# EAGLE schematic bms_v01 (EAGLE 6.5.0)
AUTHOR: John English; VERSION: 2015-02-16

## Sheet 1 of 3
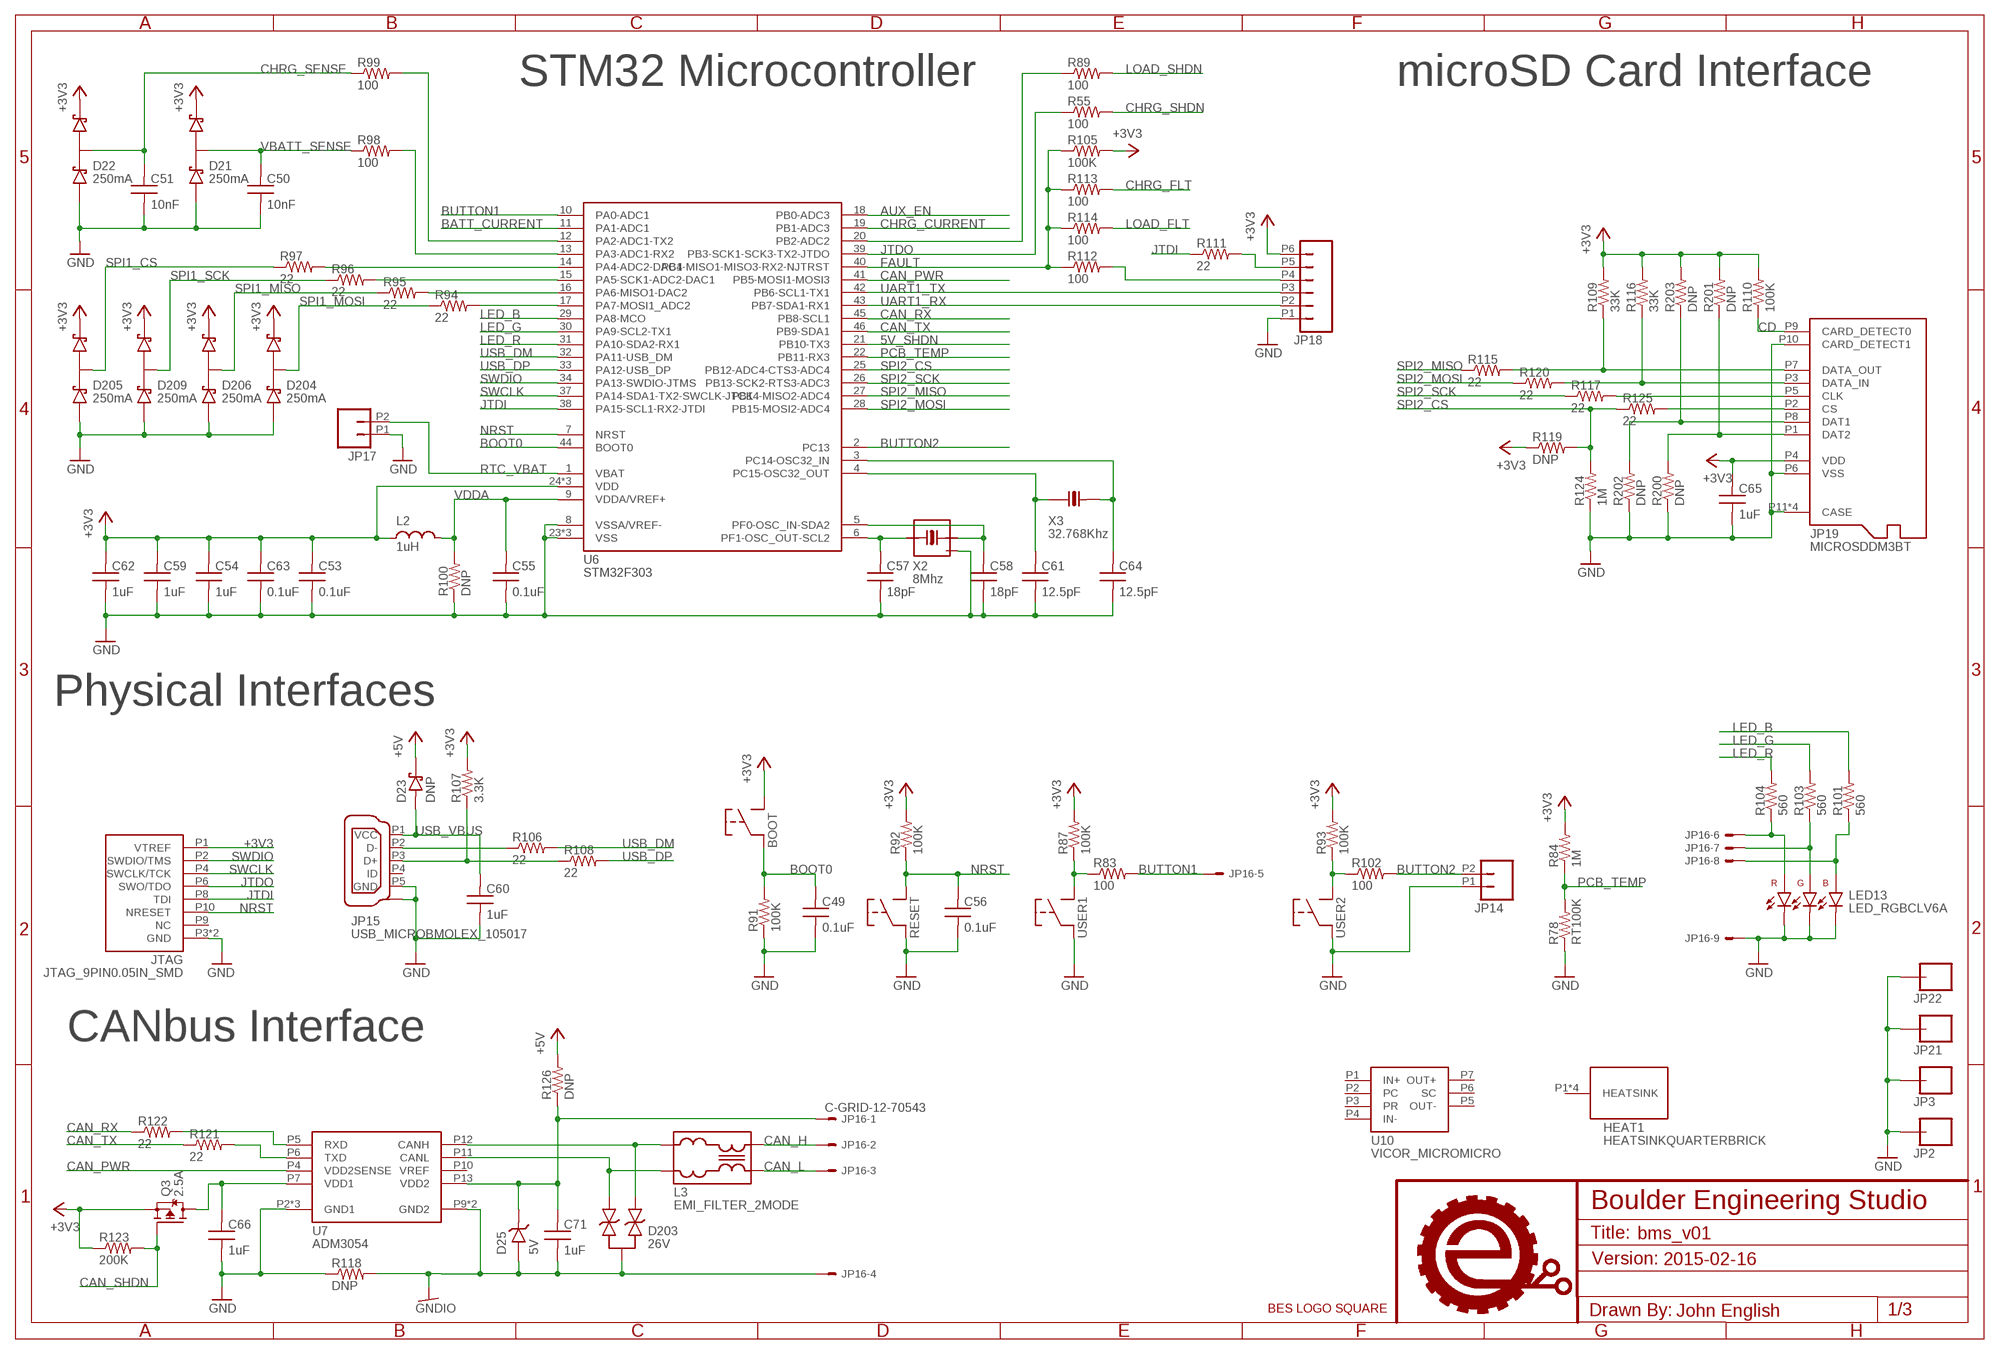
[diagram p0: schematic, sheet 1]

### Parts
BOOT  SWITCH_MOMENTEVQP2  [MOMENTARY_SW_EVQP2]
C49  0.1uF  CAPACITORC_0603_SILK  [0603_SILK]
C50  10nF  CAPACITORC_0603_SILK  [0603_SILK]
C51  10nF  CAPACITORC_0603_SILK  [0603_SILK]
C53  0.1uF  CAPACITORC_0603_SILK  [0603_SILK]
C54  1uF  CAPACITORC_0603_SILK  [0603_SILK]
C55  0.1uF  CAPACITORC_0603_SILK  [0603_SILK]
C56  0.1uF  CAPACITORC_0603_SILK  [0603_SILK]
C57  18pF  CAPACITORC_0603_SILK  [0603_SILK]
C58  18pF  CAPACITORC_0603_SILK  [0603_SILK]
C59  1uF  CAPACITORC_0603_SILK  [0603_SILK]
C60  1uF  CAPACITORC_0603_SILK  [0603_SILK]
C61  12.5pF  CAPACITORC_0603_SILK  [0603_SILK]
C62  1uF  CAPACITORC_0603_SILK  [0603_SILK]
C63  0.1uF  CAPACITORC_0603_SILK  [0603_SILK]
C64  12.5pF  CAPACITORC_0603_SILK  [0603_SILK]
C65  1uF  CAPACITORC_0603_SILK  [0603_SILK]
C66  1uF  CAPACITORC_0603_SILK  [0603_SILK]
C71  1uF  CAPACITORC_0603_SILK  [0603_SILK]
D21  250mA  DIODE_SCHOTTKY_SERIESSOT23  [SOT23]
D22  250mA  DIODE_SCHOTTKY_SERIESSOT23  [SOT23]
D23  DNP  DIODE_SCHOTTKYSOT23  [SOT23]
D25  5V  ZENERSOT23  [SOT23]
D203  26V  SUPPRESSOR_DUALSOT23  [SOT23]
D204  250mA  DIODE_SCHOTTKY_SERIESSOT23  [SOT23]
D205  250mA  DIODE_SCHOTTKY_SERIESSOT23  [SOT23]
D206  250mA  DIODE_SCHOTTKY_SERIESSOT23  [SOT23]
D209  250mA  DIODE_SCHOTTKY_SERIESSOT23  [SOT23]
HEAT1  HEATSINKQUARTERBRICK  [HEATSINK_BRICK_QUARTER]
JP2  CONNECTOR-1PIN3.5MM  [HOLE_3.5MM]
JP3  CONNECTOR-1PIN3.5MM  [HOLE_3.5MM]
JP14  HEADER-2PIN2MM  [HEADER_2MM_2PIN]
JP15  USB_MICROBMOLEX_105017  [USB-MICRO-B-MOLEX_105017]
JP16  C-GRID-12-70543  [70543-12]
JP17  HEADER-2PIN0.05IN  [HEADER-SMALL-2PIN00.05IN]
JP18  HEADER-6PIN2MM  [HEADER_2MM_6PIN]
JP19  MICROSDDM3BT  [MICROSD_DM3BT]
JP21  CONNECTOR-1PIN3.5MM  [HOLE_3.5MM]
JP22  CONNECTOR-1PIN3.5MM  [HOLE_3.5MM]
JTAG  JTAG_9PIN0.05IN_SMD  [JTAG_9PIN_0.05IN_SMD]
L2  1uH  INDUCTOR0603_SILK  [0603_SILK]
L3  EMI_FILTER_2MODE  [FILTER_EXC24CX]
LED13  LED_RGBCLV6A  [RGB_LED_CLV6A]
LOGO1  LOGOSILK_0.325IN  [LOGO_SILK_0.325IN]
Q3  2.5A  MOSFET_PSOT23  [SOT23]
R55  100  RESISTORR_0603_SILK  [0603_SILK]
R78  RT100K  RESISTORR_0603_SILK  [0603_SILK]
R83  100  RESISTORR_0603_SILK  [0603_SILK]
R84  1M  RESISTORR_0603_SILK  [0603_SILK]
R87  100K  RESISTORR_0603_SILK  [0603_SILK]
R89  100  RESISTORR_0603_SILK  [0603_SILK]
R91  100K  RESISTORR_0603_SILK  [0603_SILK]
R92  100K  RESISTORR_0603_SILK  [0603_SILK]
R93  100K  RESISTORR_0603_SILK  [0603_SILK]
R94  22  RESISTORR_0603_SILK  [0603_SILK]
R95  22  RESISTORR_0603_SILK  [0603_SILK]
R96  22  RESISTORR_0603_SILK  [0603_SILK]
R97  22  RESISTORR_0603_SILK  [0603_SILK]
R98  100  RESISTORR_0603_SILK  [0603_SILK]
R99  100  RESISTORR_0603_SILK  [0603_SILK]
R100  DNP  RESISTORR_0603_SILK  [0603_SILK]
R101  560  RESISTORR_0603_SILK  [0603_SILK]
R102  100  RESISTORR_0603_SILK  [0603_SILK]
R103  560  RESISTORR_0603_SILK  [0603_SILK]
R104  560  RESISTORR_0603_SILK  [0603_SILK]
R105  100K  RESISTORR_0603_SILK  [0603_SILK]
R106  22  RESISTORR_0603_SILK  [0603_SILK]
R107  3.3K  RESISTORR_0603_SILK  [0603_SILK]
R108  22  RESISTORR_0603_SILK  [0603_SILK]
R109  33K  RESISTORR_0603_SILK  [0603_SILK]
R110  100K  RESISTORR_0603_SILK  [0603_SILK]
R111  22  RESISTORR_0603_SILK  [0603_SILK]
R112  100  RESISTORR_0603_SILK  [0603_SILK]
R113  100  RESISTORR_0603_SILK  [0603_SILK]
R114  100  RESISTORR_0603_SILK  [0603_SILK]
R115  22  RESISTORR_0603_SILK  [0603_SILK]
R116  33K  RESISTORR_0603_SILK  [0603_SILK]
R117  22  RESISTORR_0603_SILK  [0603_SILK]
R118  DNP  RESISTORR_0603_SILK  [0603_SILK]
R119  DNP  RESISTORR_0603_SILK  [0603_SILK]
R120  22  RESISTORR_0603_SILK  [0603_SILK]
R121  22  RESISTORR_0603_SILK  [0603_SILK]
R122  22  RESISTORR_0603_SILK  [0603_SILK]
R123  200K  RESISTORR_0603_SILK  [0603_SILK]
R124  1M  RESISTORR_0603_SILK  [0603_SILK]
R125  22  RESISTORR_0603_SILK  [0603_SILK]
R126  DNP  RESISTORR_0603_SILK  [0603_SILK]
R200  DNP  RESISTORR_0603_SILK  [0603_SILK]
R201  DNP  RESISTORR_0603_SILK  [0603_SILK]
R202  DNP  RESISTORR_0603_SILK  [0603_SILK]
R203  DNP  RESISTORR_0603_SILK  [0603_SILK]
RESET  SWITCH_MOMENTEVQP2  [MOMENTARY_SW_EVQP2]
U6  STM32F303  [TQFP48]
U7  ADM3054  [SOIC-16_W_ANALOG]
U10  VICOR_MICROMICRO  [VICOR_QUARTER]
USER1  SWITCH_MOMENTEVQP2  [MOMENTARY_SW_EVQP2]
USER2  SWITCH_MOMENTEVQP2  [MOMENTARY_SW_EVQP2]
X2  8Mhz  CRYSTAL_ABRACOM_ABABM10  [ABRACOM_CLOCK]
X3  32.768Khz  CRYSTALABS07  [ABS07]

### Nets
5V_SHDN: U6.21(PB10-TX3) ; also sheet 2,3
+3V3: BOOT.P2 BOOT.P4(P2) C53.P1 C54.P1 C59.P1 C62.P1 C63.P1 C65.P1 D21.2(C) D22.2(C) D204.2(C) D205.2(C) D206.2(C) D209.2(C) JP18.P6 JP19.P4(VDD) JTAG.P1(VTREF) L2.P1 Q3.2(S) R84.P2 R87.P2 R92.P2 R93.P2 R105.P2 R107.P2 R109.P2 R110.P2 R116.P2 R119.P1 R123.P1 R201.P2 R203.P2 U6.24(VDD) U6.36(VDD) U6.48(VDD) ; also sheet 2
+5V: D23.3(C) R126.P2 ; also sheet 2
AUX_EN: U6.18(PB0-ADC3) ; also sheet 2
BATT_CURRENT: U6.11(PA1-ADC1) ; also sheet 2
BOOT0: BOOT.P1 BOOT.P3(P1) C49.P1 R91.P2 U6.44(BOOT0)
BUTTON1: JP16.5 R83.P2 U6.10(PA0-ADC1)
BUTTON2: JP14.P2 R102.P2 U6.2(PC13)
CAN_H: JP16.2 L3.P4
CAN_L: JP16.3 L3.P3
CAN_PWR: U6.41(PB5-MOSI1-MOSI3) U7.P4(VDD2SENSE)
CAN_RX: R122.P1 U6.45(PB8-SCL1)
CAN_SHDN: Q3.1(G) R123.P2 ; also sheet 3
CAN_TX: R121.P1 U6.46(PB9-SDA1)
CAN_VDD: C71.P1 D25.3(C) JP16.1 R126.P1 U7.P13(VDD2)
CD: JP19.P9(CARD_DETECT0) R110.P1
CHRG_CURRENT: U6.19(PB1-ADC3) ; also sheet 2
CHRG_FLT: R113.P2 ; also sheet 2
CHRG_SENSE: C51.P1 D22.3(MID) R99.P1 ; also sheet 2
CHRG_SHDN: R55.P2 ; also sheet 2,3
FAULT: R105.P1 R112.P1 R113.P1 R114.P1 U6.40(PB4-MISO1-MISO3-RX2-NJTRST)
GND: C49.P2 C50.P2 C51.P2 C53.P2 C54.P2 C55.P2 C56.P2 C57.P2 C58.P2 C59.P2 C60.P2 C61.P2 C62.P2 C63.P2 C64.P2 C65.P2 C66.P2 D21.1(A) D22.1(A) D204.1(A) D205.1(A) D206.1(A) D209.1(A) JP2.P$1 JP3.P$1 JP14.P1 JP15.P5(GND) JP15.PAD1(CASE) JP15.PAD2(CASE) JP15.PAD3(CASE) JP15.PAD3-HOLE(CASE) JP15.PAD4(CASE) JP15.PAD4-HOLE(CASE) JP15.THRUPAD1(CASE) JP15.THRUPAD2(CASE) JP16.9 JP17.P1 JP18.P1 JP19.P6(VSS) JP19.P10(CARD_DETECT1) JP19.P11(CASE) JP19.P12(CASE) JP19.P13(CASE) JP19.P14(CASE) JP21.P$1 JP22.P$1 JTAG.P3(GND) JTAG.P5(GND) LED13.1(BC) LED13.2(GC) LED13.3(RC) R78.P1 R91.P1 R100.P1 R118.P1 R124.P1 R200.P1 R202.P1 RESET.P1 RESET.P3(P1) U6.8(VSSA/VREF-) U6.23(VSS) U6.35(VSS) U6.47(VSS) U7.P2(GND1) U7.P3(GND1) U7.P8(GND1) USER1.P1 USER1.P3(P1) USER2.P1 USER2.P3(P1) X2.2(CASE) X2.4(CASE) ; also sheet 2,3
GNDIO: C71.P2 D25.1(A) D203.3(C1) JP16.4 R118.P2 U7.P9(GND2) U7.P16(GND2)
JTDI: JTAG.P8(TDI) R111.P1 U6.38(PA15-SCL1-RX2-JTDI)
JTDO: JTAG.P6(SWO/TDO) R55.P1 U6.39(PB3-SCK1-SCK3-TX2-JTDO)
LED_B: R101.P2 U6.29(PA8-MCO)
LED_G: R103.P2 U6.30(PA9-SCL2-TX1)
LED_R: R104.P2 U6.31(PA10-SDA2-RX1)
LOAD_FLT: R114.P2 ; also sheet 2
LOAD_SHDN: R89.P2 ; also sheet 2,3
N$2: C66.P1 Q3.3(D) U7.P7(VDD1)
N$6: D203.1(A) L3.P2 U7.P11(CANL)
N$25: R99.P2 U6.12(PA2-ADC1-TX2)
N$28: R83.P1 R87.P1 USER1.P2 USER1.P4(P2)
N$31: JP15.P2(D-) R106.P1
N$34: R93.P1 R102.P1 USER2.P2 USER2.P4(P2)
N$37: R89.P1 U6.20(PB2-ADC2)
N$39: R98.P2 U6.13(PA3-ADC1-RX2)
N$46: C58.P1 U6.5(PF0-OSC_IN-SDA2) X2.3(3A)
N$58: JP15.P3(D+) R107.P1 R108.P1
N$62: R94.P2 U6.17(PA7-MOSI1_ADC2)
N$66: R95.P2 U6.16(PA6-MISO1-DAC2)
N$71: C57.P1 U6.6(PF1-OSC_OUT-SCL2) X2.1(1A)
N$72: R96.P2 U6.15(PA5-SCK1-ADC2-DAC1)
N$73: JP19.P1(DAT2) R200.P2 R201.P1
N$74: JP19.P8(DAT1) R202.P2 R203.P1
N$75: JP19.P3(DATA_IN) R116.P1 R120.P2
N$76: JP19.P7(DATA_OUT) R109.P1 R115.P2
N$80: D203.2(A1) L3.P1 U7.P12(CANH)
N$81: R121.P2 U7.P6(TXD)
N$82: R122.P2 U7.P5(RXD)
N$85: R97.P2 U6.14(PA4-ADC2-DAC1)
N$95: C61.P1 U6.4(PC15-OSC32_OUT) X3.P1(1A)
N$96: C64.P1 U6.3(PC14-OSC32_IN) X3.P2(3A)
N$98: JP18.P4 R112.P2
N$100: JP18.P5 R111.P2
N$107: JP19.P5(CLK) R117.P2
N$142: JP19.P2(CS) R125.P2
N$143: JP16.6 LED13.4(RA) R104.P1
N$144: JP16.7 LED13.5(GA) R103.P1
N$294: JP16.8 LED13.6(BA) R101.P1
NRST: C56.P1 JTAG.P10(NRESET) R92.P1 RESET.P2 RESET.P4(P2) U6.7(NRST)
PCB_TEMP: R78.P2 R84.P1 U6.22(PB11-RX3)
RTC_VBAT: JP17.P2 U6.1(VBAT)
SPI1_CS: D205.3(MID) R97.P1 ; also sheet 3
SPI1_MISO: D206.3(MID) R95.P1 ; also sheet 3
SPI1_MOSI: D204.3(MID) R94.P1 ; also sheet 3
SPI1_SCK: D209.3(MID) R96.P1 ; also sheet 3
SPI2_CS: R119.P2 R124.P2 R125.P1 U6.25(PB12-ADC4-CTS3-ADC4)
SPI2_MISO: R115.P1 U6.27(PB14-MISO2-ADC4)
SPI2_MOSI: R120.P1 U6.28(PB15-MOSI2-ADC4)
SPI2_SCK: R117.P1 U6.26(PB13-SCK2-RTS3-ADC3)
SWCLK: JTAG.P4(SWCLK/TCK) U6.37(PA14-SDA1-TX2-SWCLK-JTCK)
SWDIO: JTAG.P2(SWDIO/TMS) U6.34(PA13-SWDIO-JTMS)
UART1_RX: JP18.P2 U6.43(PB7-SDA1-RX1)
UART1_TX: JP18.P3 U6.42(PB6-SCL1-TX1)
USB_DM: R106.P2 U6.32(PA11-USB_DM)
USB_DP: R108.P2 U6.33(PA12-USB_DP)
USB_VBUS: C60.P1 D23.1(A) JP15.P1(VCC)
VBATT_SENSE: C50.P1 D21.3(MID) R98.P1 ; also sheet 2
VDDA: C55.P1 L2.P2 R100.P2 U6.9(VDDA/VREF+)
Unconnected: HEAT1.P1(HEATSINK) HEAT1.P2(HEATSINK) HEAT1.P3(HEATSINK) HEAT1.P4(HEATSINK) JP15.P4(ID) JTAG.P9(NC) U7.P10(VREF) U10.P1(IN+) U10.P2(PC) U10.P3(PR) U10.P4(IN-) U10.P5(OUT-) U10.P6(SC) U10.P7(OUT+)

### Notes on the sheet
- STM32 Microcontroller | microSD Card Interface
- Physical Interfaces
- CANbus Interface

## Sheet 2 of 3
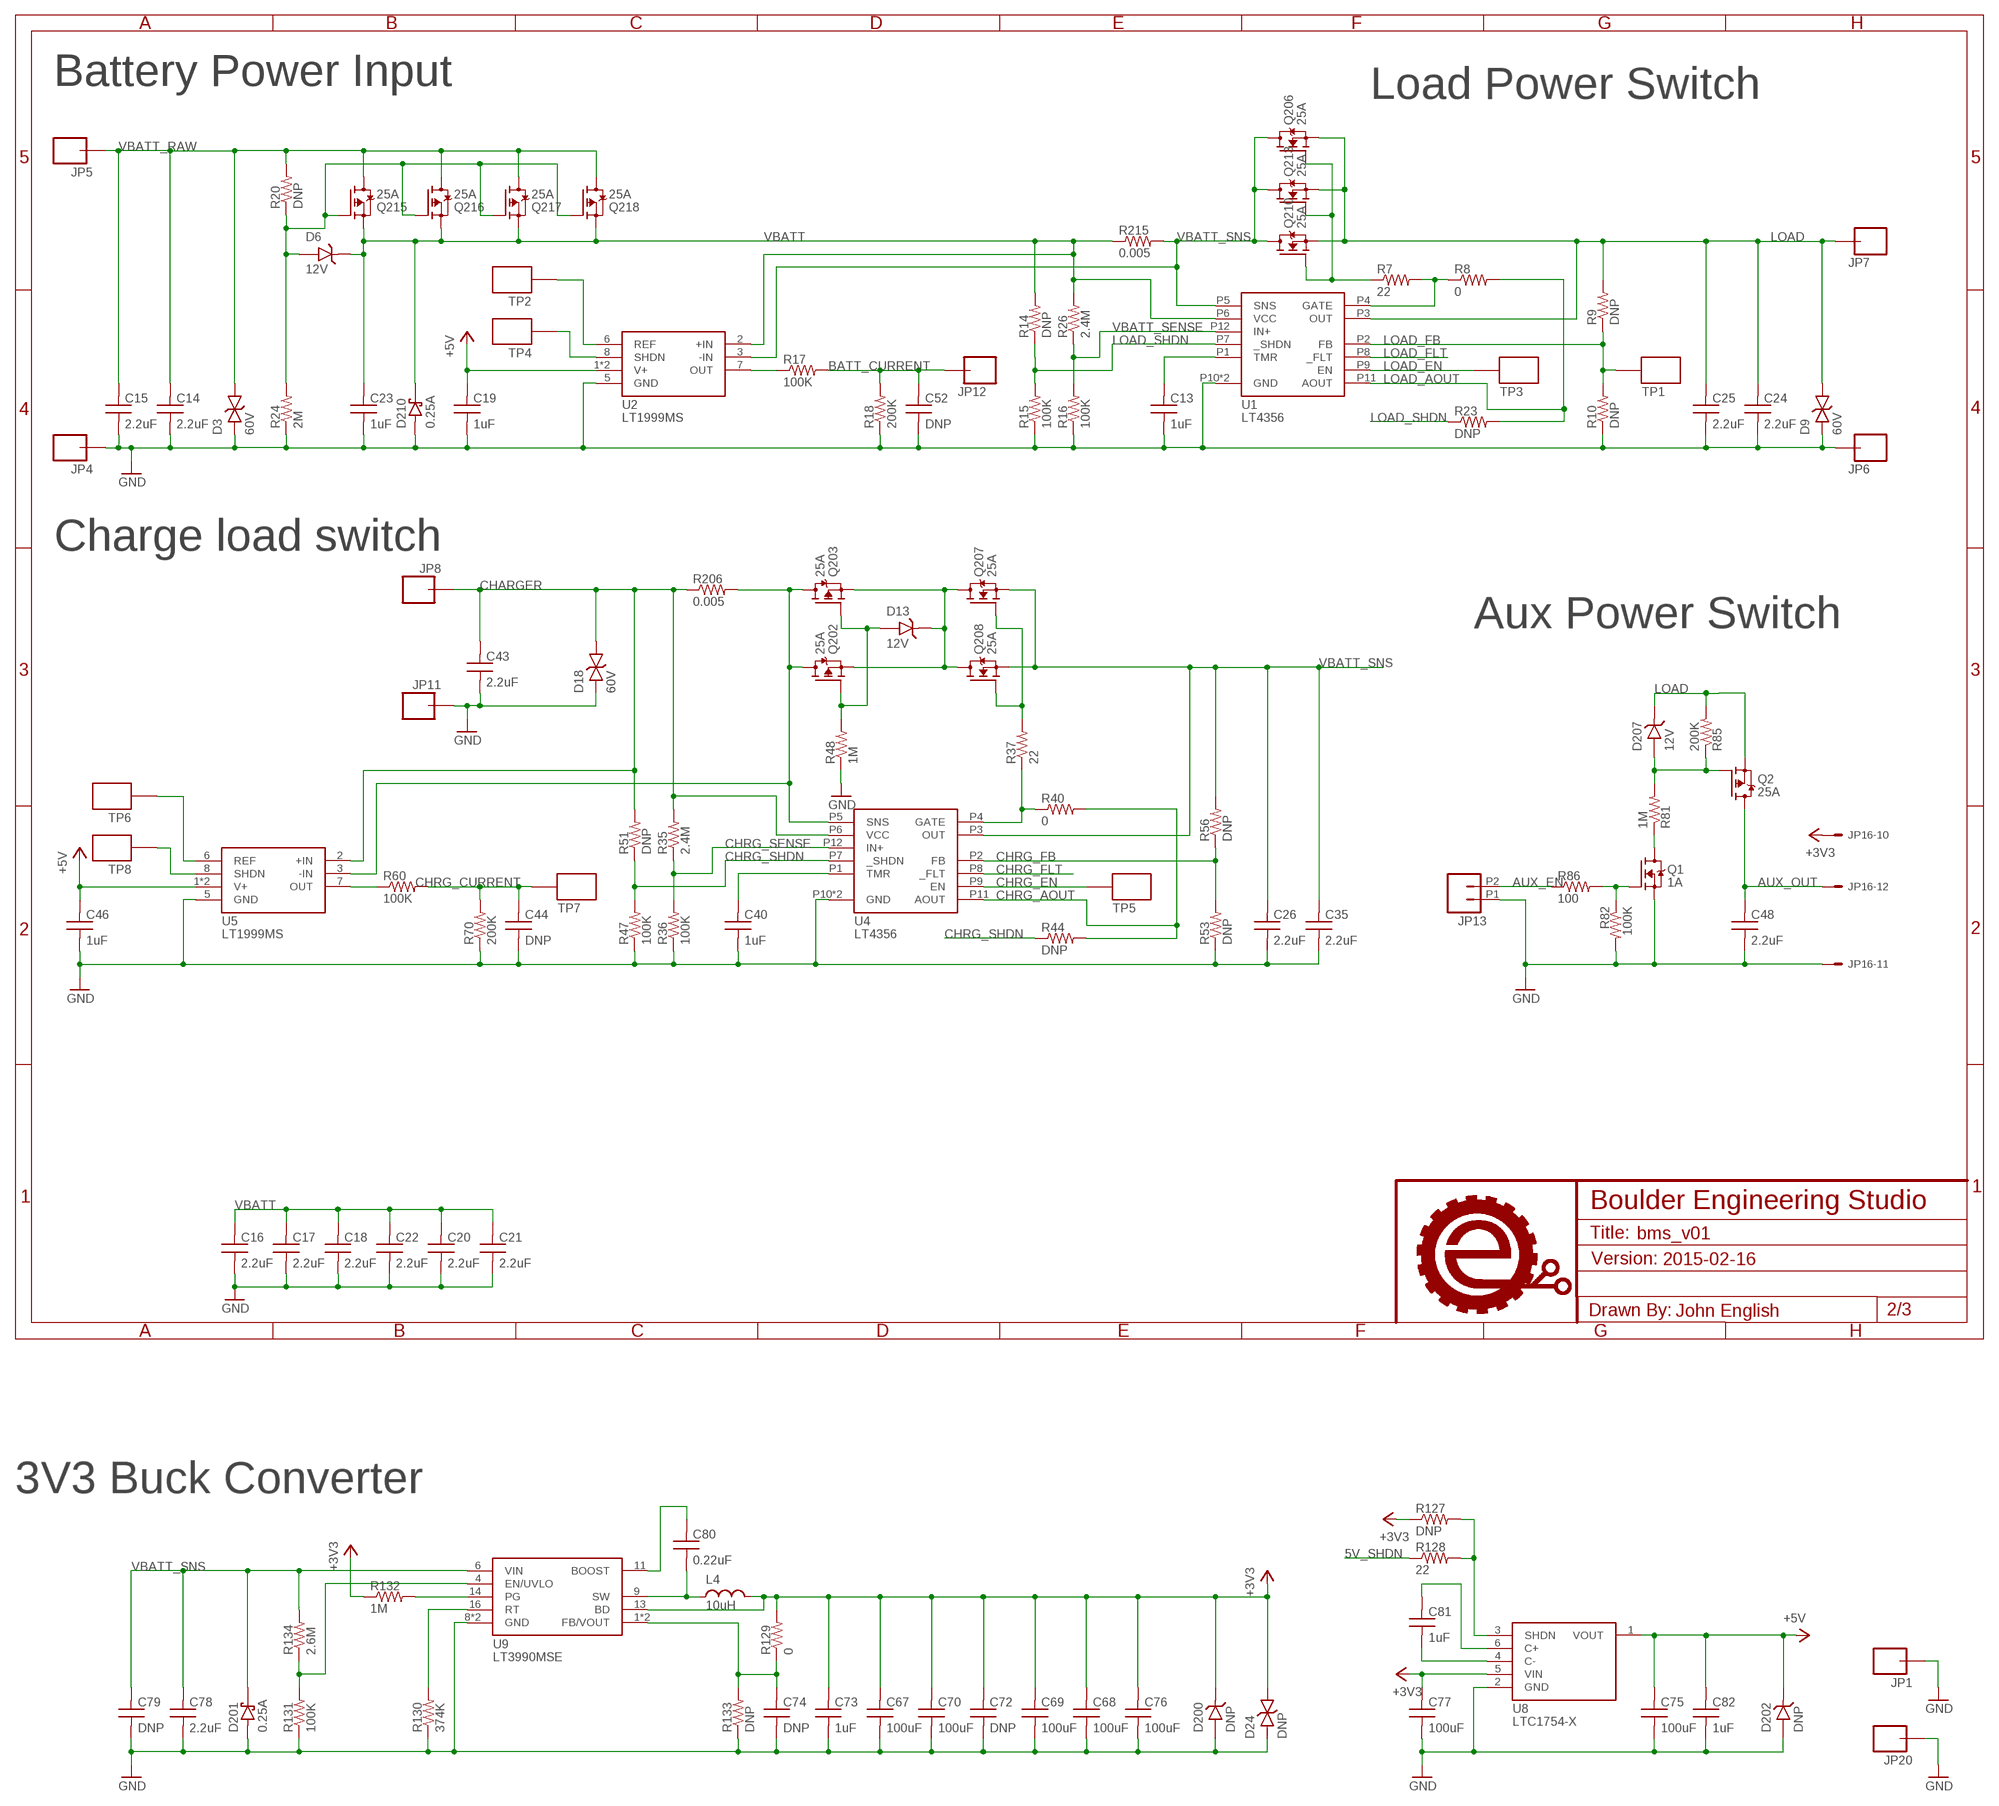
[diagram p1: schematic, sheet 2]

### Parts
C13  1uF  CAPACITORC_0603_SILK  [0603_SILK]
C14  2.2uF  CAPACITOR1210_SILK  [1210_SILK]
C15  2.2uF  CAPACITOR1210_SILK  [1210_SILK]
C16  2.2uF  CAPACITOR1210_SILK  [1210_SILK]
C17  2.2uF  CAPACITOR1210_SILK  [1210_SILK]
C18  2.2uF  CAPACITOR1210_SILK  [1210_SILK]
C19  1uF  CAPACITORC_0603_SILK  [0603_SILK]
C20  2.2uF  CAPACITOR1210_SILK  [1210_SILK]
C21  2.2uF  CAPACITOR1210_SILK  [1210_SILK]
C22  2.2uF  CAPACITOR1210_SILK  [1210_SILK]
C23  1uF  CAPACITORC_0603_SILK  [0603_SILK]
C24  2.2uF  CAPACITOR1210_SILK  [1210_SILK]
C25  2.2uF  CAPACITOR1210_SILK  [1210_SILK]
C26  2.2uF  CAPACITOR1210_SILK  [1210_SILK]
C35  2.2uF  CAPACITOR1210_SILK  [1210_SILK]
C40  1uF  CAPACITORC_0603_SILK  [0603_SILK]
C43  2.2uF  CAPACITOR1210_SILK  [1210_SILK]
C44  DNP  CAPACITORC_0603_SILK  [0603_SILK]
C46  1uF  CAPACITORC_0603_SILK  [0603_SILK]
C48  2.2uF  CAPACITOR1210_SILK  [1210_SILK]
C52  DNP  CAPACITORC_0603_SILK  [0603_SILK]
C67  100uF  CAPACITORC_1206_SILK  [1206_SILK]
C68  100uF  CAPACITORC_1206_SILK  [1206_SILK]
C69  100uF  CAPACITORC_1206_SILK  [1206_SILK]
C70  100uF  CAPACITORC_1206_SILK  [1206_SILK]
C72  DNP  CAPACITORC_0603_SILK  [0603_SILK]
C73  1uF  CAPACITORC_0603_SILK  [0603_SILK]
C74  DNP  CAPACITORC_0603_SILK  [0603_SILK]
C75  100uF  CAPACITORC_1206_SILK  [1206_SILK]
C76  100uF  CAPACITORC_1206_SILK  [1206_SILK]
C77  100uF  CAPACITORC_1206_SILK  [1206_SILK]
C78  2.2uF  CAPACITOR1210_SILK  [1210_SILK]
C79  DNP  CAPACITORC_0603_SILK  [0603_SILK]
C80  0.22uF  CAPACITORC_0603_SILK  [0603_SILK]
C81  1uF  CAPACITORC_0603_SILK  [0603_SILK]
C82  1uF  CAPACITORC_0603_SILK  [0603_SILK]
D3  60V  SURGESUPPRESSORSMC  [SMC]
D6  12V  ZENERSOT23  [SOT23]
D9  60V  SURGESUPPRESSORSMC  [SMC]
D13  12V  ZENERSOT23  [SOT23]
D18  60V  SURGESUPPRESSORSMC  [SMC]
D24  DNP  SURGESUPPRESSORSMA  [SMA]
D200  DNP  ZENERSOT23  [SOT23]
D201  0.25A  DIODE_SCHOTTKYSOT23  [SOT23]
D202  DNP  ZENERSOT23  [SOT23]
D207  12V  ZENERSOT23  [SOT23]
D210  0.25A  DIODE_SCHOTTKYSOT23  [SOT23]
JP1  HEADER-1PIN0.036IN  [HEADER-SMALL-1PIN-0.036IN]
JP4  CONNECTOR-1PIN3MM  [HOLE_3MM]
JP5  CONNECTOR-1PIN3MM  [HOLE_3MM]
JP6  CONNECTOR-1PIN3MM  [HOLE_3MM]
JP7  CONNECTOR-1PIN3MM  [HOLE_3MM]
JP8  CONNECTOR-1PIN3MM  [HOLE_3MM]
JP11  CONNECTOR-1PIN3MM  [HOLE_3MM]
JP12  HEADER-1PIN0.02IN  [HEADER-SMALL-1PIN-0.02IN]
JP13  HEADER-2PIN2MM  [HEADER_2MM_2PIN]
JP20  HEADER-1PIN0.036IN  [HEADER-SMALL-1PIN-0.036IN]
L4  10uH  INDUCTORRL895  [INDUCTOR_RL895]
Q1  1A  MOSFET_NSOT23  [SOT23]
Q2  25A  MOSFET_PPOWERPAK_SO8  [POWERPAK_SO-8_SINGLE]
Q202  25A  MOSFET_PPOWERPAK_SO8  [POWERPAK_SO-8_SINGLE]
Q203  25A  MOSFET_PPOWERPAK_SO8  [POWERPAK_SO-8_SINGLE]
Q206  25A  MOSFET_NPOWERPAK_SO8  [POWERPAK_SO-8_SINGLE]
Q207  25A  MOSFET_NPOWERPAK_SO8  [POWERPAK_SO-8_SINGLE]
Q208  25A  MOSFET_NPOWERPAK_SO8  [POWERPAK_SO-8_SINGLE]
Q210  25A  MOSFET_NPOWERPAK_SO8  [POWERPAK_SO-8_SINGLE]
Q213  25A  MOSFET_NPOWERPAK_SO8  [POWERPAK_SO-8_SINGLE]
Q215  25A  MOSFET_PPOWERPAK_SO8  [POWERPAK_SO-8_SINGLE]
Q216  25A  MOSFET_PPOWERPAK_SO8  [POWERPAK_SO-8_SINGLE]
Q217  25A  MOSFET_PPOWERPAK_SO8  [POWERPAK_SO-8_SINGLE]
Q218  25A  MOSFET_PPOWERPAK_SO8  [POWERPAK_SO-8_SINGLE]
R7  22  RESISTORR_0805_SILK  [0805_SILK]
R8  0  RESISTORR_0805_SILK  [0805_SILK]
R9  DNP  RESISTORR_0603_SILK  [0603_SILK]
R10  DNP  RESISTORR_0603_SILK  [0603_SILK]
R14  DNP  RESISTORR_0603_SILK  [0603_SILK]
R15  100K  RESISTORR_0603_SILK  [0603_SILK]
R16  100K  RESISTORR_0603_SILK  [0603_SILK]
R17  100K  RESISTORR_0603_SILK  [0603_SILK]
R18  200K  RESISTORR_0603_SILK  [0603_SILK]
R20  DNP  RESISTORR_0603_SILK  [0603_SILK]
R23  DNP  RESISTORR_0805_SILK  [0805_SILK]
R24  2M  RESISTORR_0603_SILK  [0603_SILK]
R26  2.4M  RESISTORR_0603_SILK  [0603_SILK]
R35  2.4M  RESISTORR_0603_SILK  [0603_SILK]
R36  100K  RESISTORR_0603_SILK  [0603_SILK]
R37  22  RESISTORR_0603_SILK  [0603_SILK]
R40  0  RESISTORR_0603_SILK  [0603_SILK]
R44  DNP  RESISTORR_0603_SILK  [0603_SILK]
R47  100K  RESISTORR_0603_SILK  [0603_SILK]
R48  1M  RESISTORR_0603_SILK  [0603_SILK]
R51  DNP  RESISTORR_0603_SILK  [0603_SILK]
R53  DNP  RESISTORR_0603_SILK  [0603_SILK]
R56  DNP  RESISTORR_0603_SILK  [0603_SILK]
R60  100K  RESISTORR_0603_SILK  [0603_SILK]
R70  200K  RESISTORR_0603_SILK  [0603_SILK]
R81  1M  RESISTORR_0603_SILK  [0603_SILK]
R82  100K  RESISTORR_0603_SILK  [0603_SILK]
R85  200K  RESISTORR_0603_SILK  [0603_SILK]
R86  100  RESISTORR_0603_SILK  [0603_SILK]
R127  DNP  RESISTORR_0603_SILK  [0603_SILK]
R128  22  RESISTORR_0603_SILK  [0603_SILK]
R129  0  RESISTORR_0603_SILK  [0603_SILK]
R130  374K  RESISTORR_0603_SILK  [0603_SILK]
R131  100K  RESISTORR_0603_SILK  [0603_SILK]
R132  1M  RESISTORR_0603_SILK  [0603_SILK]
R133  DNP  RESISTORR_0603_SILK  [0603_SILK]
R134  2.6M  RESISTORR_0603_SILK  [0603_SILK]
R206  0.005  RESISTOR2725_SILK  [2725_SILK]
R215  0.005  RESISTOR2725_SILK  [2725_SILK]
TP1  TEST_POINT0.036IN  [TEST_POINT_0.036IN]
TP2  TEST_POINT0.036IN  [TEST_POINT_0.036IN]
TP3  TEST_POINT0.025IN  [TEST_POINT_0.025IN]
TP4  TEST_POINT0.036IN  [TEST_POINT_0.036IN]
TP5  TEST_POINT0.025IN  [TEST_POINT_0.025IN]
TP6  TEST_POINT0.036IN  [TEST_POINT_0.036IN]
TP7  TEST_POINT0.036IN  [TEST_POINT_0.036IN]
TP8  TEST_POINT0.036IN  [TEST_POINT_0.036IN]
U1  LT4356  [DFN12]
U2  LT1999MS  [MSOP-8_LT]
U4  LT4356  [DFN12]
U5  LT1999MS  [MSOP-8_LT]
U8  LTC1754-X  [SOT23-6]
U9  LT3990MSE  [17_MSOP]

### Nets
5V_SHDN: R128.P1 ; also sheet 1,3
+3V3: C67.P1 C68.P1 C69.P1 C70.P1 C72.P1 C73.P1 C76.P1 C77.P1 D24.C D200.3(C) JP16.10 L4.P2 R127.P1 R129.P2 R132.P1 U8.5(VIN) U9.13(BD) ; also sheet 1
+5V: C19.P1 C46.P1 C75.P1 C82.P1 D202.3(C) U2.1(V+) U2.4(V+) U5.1(V+) U5.4(V+) U8.1(VOUT) ; also sheet 1
AUX_EN: JP13.P2 R86.P1 ; also sheet 1
AUX_OUT: C48.1 JP16.12 Q2.5D(D) Q2.6D(D) Q2.7D(D) Q2.8D(D) Q2.9D(D)
BATT_CURRENT: C52.P1 JP12.P1 R17.P2 R18.P2 ; also sheet 1
CHARGER: C43.1 D18.C JP8.P1 R35.P2 R51.P2 R206.P1 U4.P6(VCC) U5.2(+IN)
CHARGER_SENSE: Q202.5D(D) Q202.6D(D) Q202.7D(D) Q202.8D(D) Q202.9D(D) Q203.5D(D) Q203.6D(D) Q203.7D(D) Q203.8D(D) Q203.9D(D) R206.P2 U4.P5(SNS) U5.3(-IN)
CHRG_AOUT: R40.P2 R44.P2 U4.P11(AOUT)
CHRG_CURRENT: C44.P1 R60.P2 R70.P2 TP7.P1 ; also sheet 1
CHRG_EN: TP5.P1 U4.P9(EN)
CHRG_FB: R53.P2 R56.P1 U4.P2(FB)
CHRG_FLT: U4.P8(_FLT) ; also sheet 1
CHRG_SENSE: R35.P1 R36.P2 U4.P12(IN+) ; also sheet 1
CHRG_SHDN: R44.P1 R47.P2 R51.P1 U4.P7(_SHDN) ; also sheet 1,3
GND: C13.P2 C14.2 C15.2 C16.2 C17.2 C18.2 C19.P2 C20.2 C21.2 C22.2 C23.P2 C24.2 C25.2 C26.2 C35.2 C40.P2 C43.2 C44.P2 C46.P2 C48.2 C52.P2 C67.P2 C68.P2 C69.P2 C70.P2 C72.P2 C73.P2 C74.P2 C75.P2 C76.P2 C77.P2 C78.2 C79.P2 C82.P2 D3.A D9.A D18.A D24.A D200.1(A) D201.1(A) D202.1(A) D210.1(A) JP1.P1 JP4.P1 JP6.P1 JP11.P1 JP13.P1 JP16.11 JP20.P1 Q1.2(S) R10.P1 R15.P1 R16.P1 R18.P1 R24.P1 R36.P1 R47.P1 R48.P1 R53.P1 R70.P1 R82.P2 R130.P1 R131.P1 R133.P1 U1.P10(GND) U1.TAB(GND) U2.5(GND) U4.P10(GND) U4.TAB(GND) U5.5(GND) U8.2(GND) U9.8(GND) U9.17(GND) ; also sheet 1,3
LOAD: C24.1 C25.1 D9.C D207.3(C) JP7.P1 Q2.1S(S) Q2.2S(S) Q2.3S(S) Q206.1S(S) Q206.2S(S) Q206.3S(S) Q210.1S(S) Q210.2S(S) Q210.3S(S) Q213.1S(S) Q213.2S(S) Q213.3S(S) R9.P2 R85.P2 U1.P3(OUT)
LOAD_AOUT: R8.P2 R23.P2 U1.P11(AOUT)
LOAD_EN: TP3.P1 U1.P9(EN)
LOAD_FB: R9.P1 R10.P2 TP1.P1 U1.P2(FB)
LOAD_FLT: U1.P8(_FLT) ; also sheet 1
LOAD_SHDN: R14.P1 R15.P2 R23.P1 U1.P7(_SHDN) ; also sheet 1,3
N$3: C80.P2 L4.P1 U9.9(SW)
N$4: R60.P1 U5.7(OUT)
N$7: R131.P2 R134.P1 U9.4(EN/UVLO)
N$8: R132.P2 U9.14(PG)
N$9: R127.P2 R128.P2 U8.3(SHDN)
N$10: C40.P1 U4.P1(TMR)
N$11: Q207.4G(G) Q208.4G(G) R37.P2
N$12: R37.P1 R40.P1 U4.P4(GATE)
N$14: Q1.1(G) R82.P1 R86.P2
N$15: C13.P1 U1.P1(TMR)
N$19: D207.1(A) Q2.4G(G) R81.P2 R85.P1
N$22: C80.P1 U9.11(BOOST)
N$23: Q1.3(D) R81.P1
N$26: TP6.P1 U5.6(REF)
N$27: R130.P2 U9.16(RT)
N$29: R17.P1 U2.7(OUT)
N$30: Q206.4G(G) Q210.4G(G) Q213.4G(G) R7.P1
N$33: TP2.P1 U2.6(REF)
N$35: R7.P2 R8.P1 U1.P4(GATE)
N$36: TP8.P1 U5.8(SHDN)
N$40: TP4.P1 U2.8(SHDN)
N$45: D13.1(A) Q202.4G(G) Q203.4G(G) R48.P2
N$78: C74.P1 R129.P1 R133.P2 U9.1(FB/VOUT) U9.2(FB/VOUT)
N$92: D6.1(A) Q215.4G(G) Q216.4G(G) Q217.4G(G) Q218.4G(G) R20.P1 R24.P2
N$117: C81.P2 U8.4(C-)
N$118: C81.P1 U8.6(C+)
VBATT: C16.1 C17.1 C18.1 C20.1 C21.1 C22.1 C23.P1 D6.3(C) D210.3(C) Q215.1S(S) Q215.2S(S) Q215.3S(S) Q216.1S(S) Q216.2S(S) Q216.3S(S) Q217.1S(S) Q217.2S(S) Q217.3S(S) Q218.1S(S) Q218.2S(S) Q218.3S(S) R14.P2 R26.P2 R215.P1 U1.P6(VCC) U2.2(+IN)
VBATT_RAW: C14.1 C15.1 D3.C JP5.P1 Q215.5D(D) Q215.6D(D) Q215.7D(D) Q215.8D(D) Q215.9D(D) Q216.5D(D) Q216.6D(D) Q216.7D(D) Q216.8D(D) Q216.9D(D) Q217.5D(D) Q217.6D(D) Q217.7D(D) Q217.8D(D) Q217.9D(D) Q218.5D(D) Q218.6D(D) Q218.7D(D) Q218.8D(D) Q218.9D(D) R20.P2
VBATT_SENSE: R16.P2 R26.P1 U1.P12(IN+) ; also sheet 1
VBATT_SNS: C26.1 C35.1 C78.1 C79.P1 D201.3(C) Q206.5D(D) Q206.6D(D) Q206.7D(D) Q206.8D(D) Q206.9D(D) Q207.1S(S) Q207.2S(S) Q207.3S(S) Q208.1S(S) Q208.2S(S) Q208.3S(S) Q210.5D(D) Q210.6D(D) Q210.7D(D) Q210.8D(D) Q210.9D(D) Q213.5D(D) Q213.6D(D) Q213.7D(D) Q213.8D(D) Q213.9D(D) R56.P2 R134.P2 R215.P2 U1.P5(SNS) U2.3(-IN) U4.P3(OUT) U9.6(VIN)
VCHARGER_SENSE: D13.3(C) Q202.1S(S) Q202.2S(S) Q202.3S(S) Q203.1S(S) Q203.2S(S) Q203.3S(S) Q207.5D(D) Q207.6D(D) Q207.7D(D) Q207.8D(D) Q207.9D(D) Q208.5D(D) Q208.6D(D) Q208.7D(D) Q208.8D(D) Q208.9D(D)

### Notes on the sheet
- Battery Power Input | Load Power Switch
- Charge load switch
- Aux Power Switch
- 3V3 Buck Converter

## Sheet 3 of 3
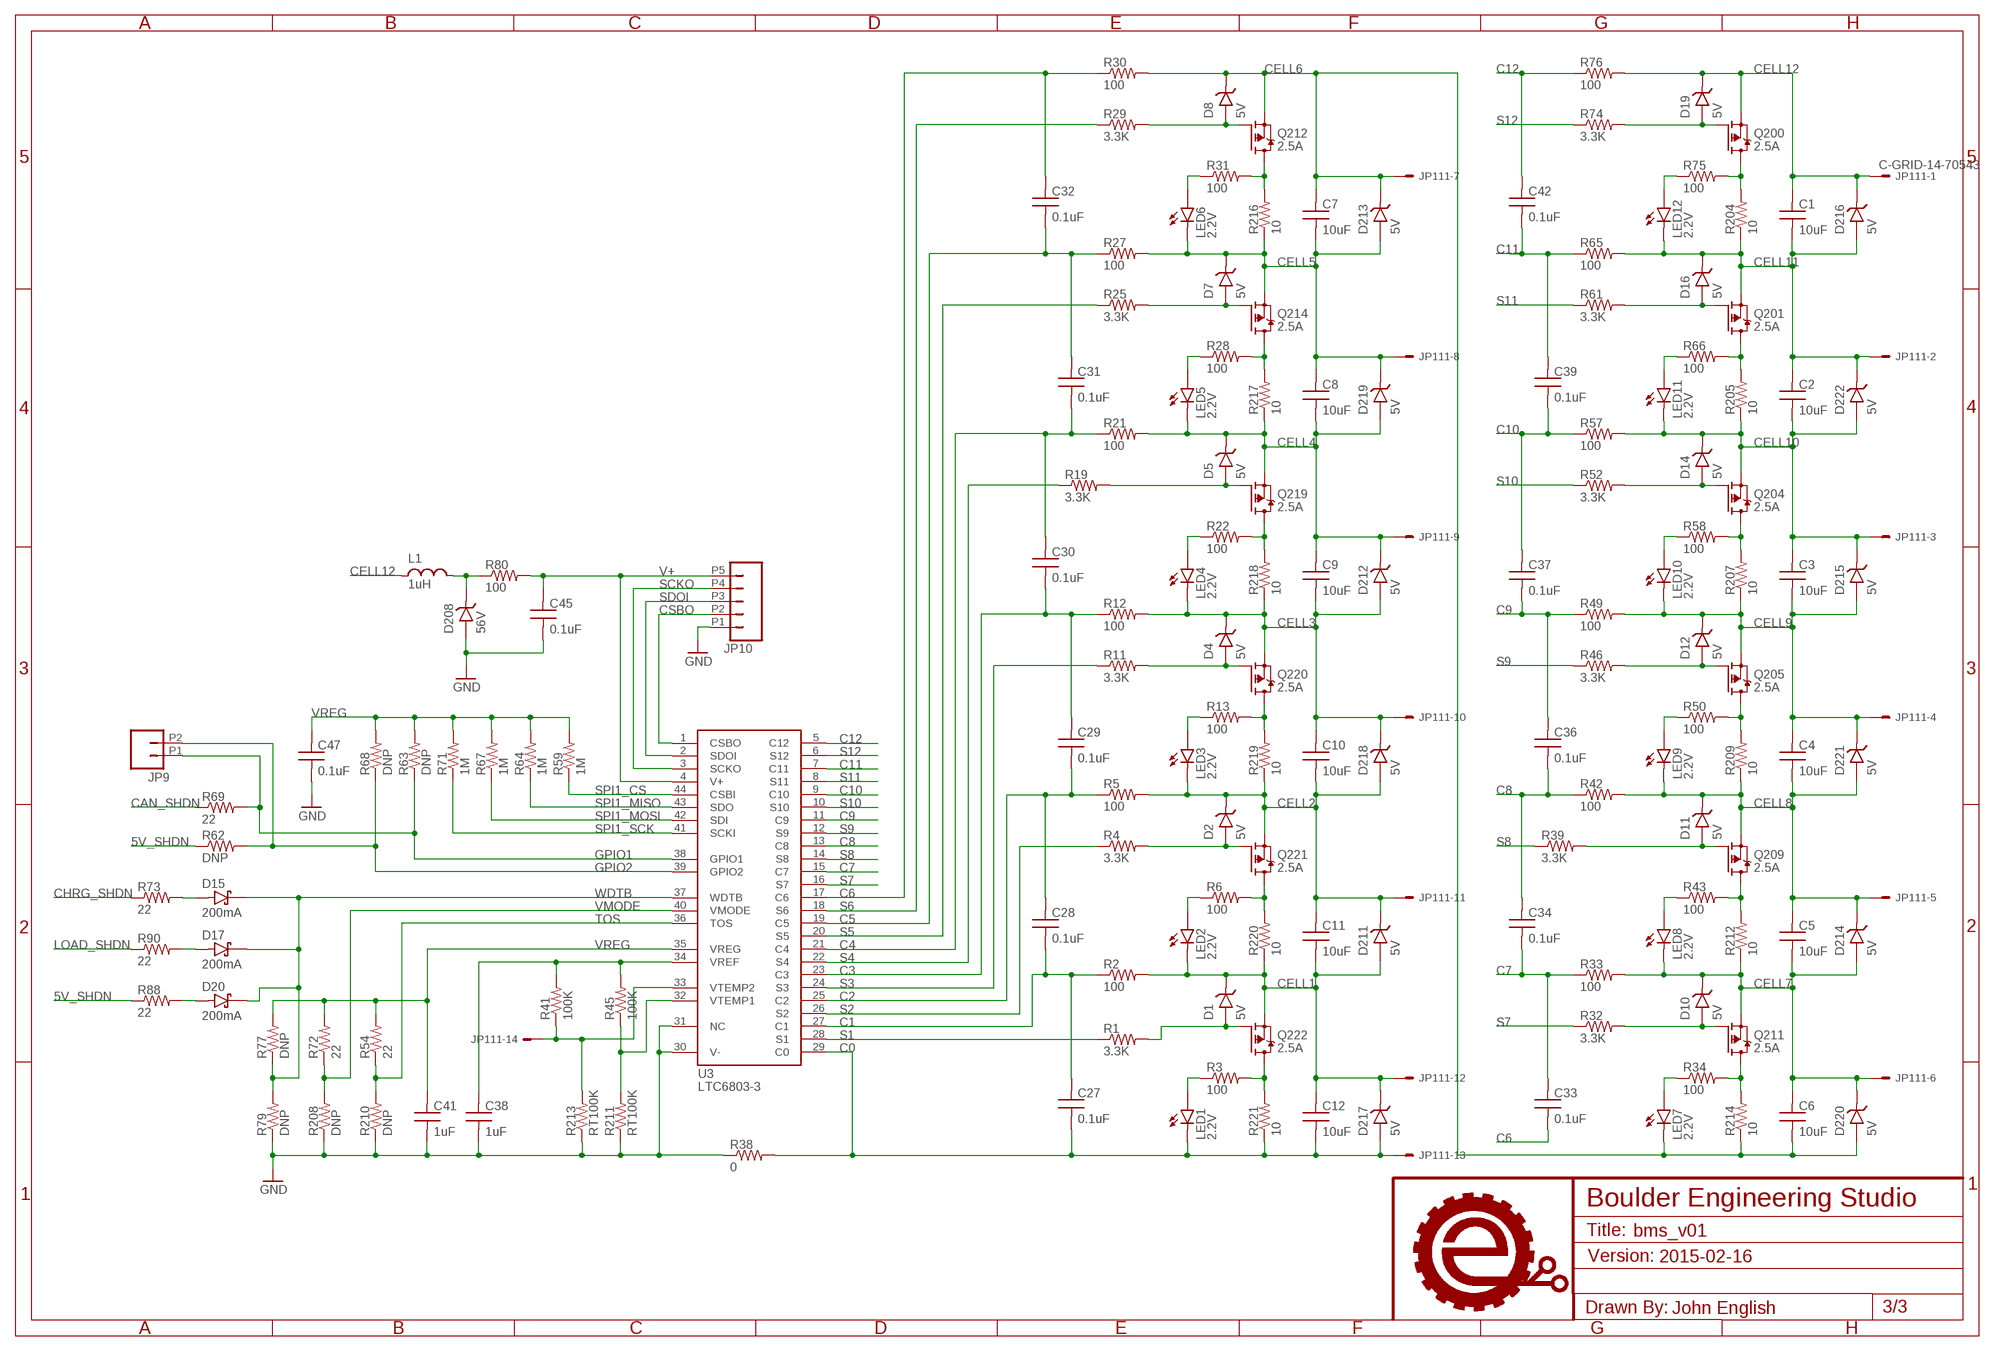
[diagram p2: schematic, sheet 3]

### Parts
C1  10uF  CAPACITORC_1206_SILK  [1206_SILK]
C2  10uF  CAPACITORC_1206_SILK  [1206_SILK]
C3  10uF  CAPACITORC_1206_SILK  [1206_SILK]
C4  10uF  CAPACITORC_1206_SILK  [1206_SILK]
C5  10uF  CAPACITORC_1206_SILK  [1206_SILK]
C6  10uF  CAPACITORC_1206_SILK  [1206_SILK]
C7  10uF  CAPACITORC_1206_SILK  [1206_SILK]
C8  10uF  CAPACITORC_1206_SILK  [1206_SILK]
C9  10uF  CAPACITORC_1206_SILK  [1206_SILK]
C10  10uF  CAPACITORC_1206_SILK  [1206_SILK]
C11  10uF  CAPACITORC_1206_SILK  [1206_SILK]
C12  10uF  CAPACITORC_1206_SILK  [1206_SILK]
C27  0.1uF  CAPACITORC_0603_SILK  [0603_SILK]
C28  0.1uF  CAPACITORC_0603_SILK  [0603_SILK]
C29  0.1uF  CAPACITORC_0603_SILK  [0603_SILK]
C30  0.1uF  CAPACITORC_0603_SILK  [0603_SILK]
C31  0.1uF  CAPACITORC_0603_SILK  [0603_SILK]
C32  0.1uF  CAPACITORC_0603_SILK  [0603_SILK]
C33  0.1uF  CAPACITORC_0603_SILK  [0603_SILK]
C34  0.1uF  CAPACITORC_0603_SILK  [0603_SILK]
C36  0.1uF  CAPACITORC_0603_SILK  [0603_SILK]
C37  0.1uF  CAPACITORC_0603_SILK  [0603_SILK]
C38  1uF  CAPACITORC_0603_SILK  [0603_SILK]
C39  0.1uF  CAPACITORC_0603_SILK  [0603_SILK]
C41  1uF  CAPACITORC_0603_SILK  [0603_SILK]
C42  0.1uF  CAPACITORC_0603_SILK  [0603_SILK]
C45  0.1uF  CAPACITORC_0603_SILK  [0603_SILK]
C47  0.1uF  CAPACITORC_0603_SILK  [0603_SILK]
D1  5V  ZENERSOT23  [SOT23]
D2  5V  ZENERSOT23  [SOT23]
D4  5V  ZENERSOT23  [SOT23]
D5  5V  ZENERSOT23  [SOT23]
D7  5V  ZENERSOT23  [SOT23]
D8  5V  ZENERSOT23  [SOT23]
D10  5V  ZENERSOT23  [SOT23]
D11  5V  ZENERSOT23  [SOT23]
D12  5V  ZENERSOT23  [SOT23]
D14  5V  ZENERSOT23  [SOT23]
D15  200mA  DIODE_SCHOTTKYSOT23  [SOT23]
D16  5V  ZENERSOT23  [SOT23]
D17  200mA  DIODE_SCHOTTKYSOT23  [SOT23]
D19  5V  ZENERSOT23  [SOT23]
D20  200mA  DIODE_SCHOTTKYSOT23  [SOT23]
D208  56V  ZENERSOT23  [SOT23]
D211  5V  ZENERSOT23  [SOT23]
D212  5V  ZENERSOT23  [SOT23]
D213  5V  ZENERSOT23  [SOT23]
D214  5V  ZENERSOT23  [SOT23]
D215  5V  ZENERSOT23  [SOT23]
D216  5V  ZENERSOT23  [SOT23]
D217  5V  ZENERSOT23  [SOT23]
D218  5V  ZENERSOT23  [SOT23]
D219  5V  ZENERSOT23  [SOT23]
D220  5V  ZENERSOT23  [SOT23]
D221  5V  ZENERSOT23  [SOT23]
D222  5V  ZENERSOT23  [SOT23]
JP9  HEADER-2PIN0.05IN  [HEADER-SMALL-2PIN00.05IN]
JP10  HEADER-5PIN2MM  [HEADER_2MM_5PIN]
JP111  C-GRID-14-70543  [70543-14]
L1  1uH  INDUCTOR0603_SILK  [0603_SILK]
LED1  2.2V  LED0603  [LED_0603]
LED2  2.2V  LED0603  [LED_0603]
LED3  2.2V  LED0603  [LED_0603]
LED4  2.2V  LED0603  [LED_0603]
LED5  2.2V  LED0603  [LED_0603]
LED6  2.2V  LED0603  [LED_0603]
LED7  2.2V  LED0603  [LED_0603]
LED8  2.2V  LED0603  [LED_0603]
LED9  2.2V  LED0603  [LED_0603]
LED10  2.2V  LED0603  [LED_0603]
LED11  2.2V  LED0603  [LED_0603]
LED12  2.2V  LED0603  [LED_0603]
Q200  2.5A  MOSFET_PSOT23  [SOT23]
Q201  2.5A  MOSFET_PSOT23  [SOT23]
Q204  2.5A  MOSFET_PSOT23  [SOT23]
Q205  2.5A  MOSFET_PSOT23  [SOT23]
Q209  2.5A  MOSFET_PSOT23  [SOT23]
Q211  2.5A  MOSFET_PSOT23  [SOT23]
Q212  2.5A  MOSFET_PSOT23  [SOT23]
Q214  2.5A  MOSFET_PSOT23  [SOT23]
Q219  2.5A  MOSFET_PSOT23  [SOT23]
Q220  2.5A  MOSFET_PSOT23  [SOT23]
Q221  2.5A  MOSFET_PSOT23  [SOT23]
Q222  2.5A  MOSFET_PSOT23  [SOT23]
R1  3.3K  RESISTORR_0603_SILK  [0603_SILK]
R2  100  RESISTORR_0603_SILK  [0603_SILK]
R3  100  RESISTORR_0603_SILK  [0603_SILK]
R4  3.3K  RESISTORR_0603_SILK  [0603_SILK]
R5  100  RESISTORR_0603_SILK  [0603_SILK]
R6  100  RESISTORR_0603_SILK  [0603_SILK]
R11  3.3K  RESISTORR_0603_SILK  [0603_SILK]
R12  100  RESISTORR_0603_SILK  [0603_SILK]
R13  100  RESISTORR_0603_SILK  [0603_SILK]
R19  3.3K  RESISTORR_0603_SILK  [0603_SILK]
R21  100  RESISTORR_0603_SILK  [0603_SILK]
R22  100  RESISTORR_0603_SILK  [0603_SILK]
R25  3.3K  RESISTORR_0603_SILK  [0603_SILK]
R27  100  RESISTORR_0603_SILK  [0603_SILK]
R28  100  RESISTORR_0603_SILK  [0603_SILK]
R29  3.3K  RESISTORR_0603_SILK  [0603_SILK]
R30  100  RESISTORR_0603_SILK  [0603_SILK]
R31  100  RESISTORR_0603_SILK  [0603_SILK]
R32  3.3K  RESISTORR_0603_SILK  [0603_SILK]
R33  100  RESISTORR_0603_SILK  [0603_SILK]
R34  100  RESISTORR_0603_SILK  [0603_SILK]
R38  0  RESISTORR_0603_SILK  [0603_SILK]
R39  3.3K  RESISTORR_0603_SILK  [0603_SILK]
R41  100K  RESISTORR_0603_SILK  [0603_SILK]
R42  100  RESISTORR_0603_SILK  [0603_SILK]
R43  100  RESISTORR_0603_SILK  [0603_SILK]
R45  100K  RESISTORR_0603_SILK  [0603_SILK]
R46  3.3K  RESISTORR_0603_SILK  [0603_SILK]
R49  100  RESISTORR_0603_SILK  [0603_SILK]
R50  100  RESISTORR_0603_SILK  [0603_SILK]
R52  3.3K  RESISTORR_0603_SILK  [0603_SILK]
R54  22  RESISTORR_0603_SILK  [0603_SILK]
R57  100  RESISTORR_0603_SILK  [0603_SILK]
R58  100  RESISTORR_0603_SILK  [0603_SILK]
R59  1M  RESISTORR_0603_SILK  [0603_SILK]
R61  3.3K  RESISTORR_0603_SILK  [0603_SILK]
R62  DNP  RESISTORR_0603_SILK  [0603_SILK]
R63  DNP  RESISTORR_0603_SILK  [0603_SILK]
R64  1M  RESISTORR_0603_SILK  [0603_SILK]
R65  100  RESISTORR_0603_SILK  [0603_SILK]
R66  100  RESISTORR_0603_SILK  [0603_SILK]
R67  1M  RESISTORR_0603_SILK  [0603_SILK]
R68  DNP  RESISTORR_0603_SILK  [0603_SILK]
R69  22  RESISTORR_0603_SILK  [0603_SILK]
R71  1M  RESISTORR_0603_SILK  [0603_SILK]
R72  22  RESISTORR_0603_SILK  [0603_SILK]
R73  22  RESISTORR_0603_SILK  [0603_SILK]
R74  3.3K  RESISTORR_0603_SILK  [0603_SILK]
R75  100  RESISTORR_0603_SILK  [0603_SILK]
R76  100  RESISTORR_0603_SILK  [0603_SILK]
R77  DNP  RESISTORR_0603_SILK  [0603_SILK]
R79  DNP  RESISTORR_0603_SILK  [0603_SILK]
R80  100  RESISTORR_0603_SILK  [0603_SILK]
R88  22  RESISTORR_0603_SILK  [0603_SILK]
R90  22  RESISTORR_0603_SILK  [0603_SILK]
R204  10  RESISTOR2512_SILK  [2512_SILK]
R205  10  RESISTOR2512_SILK  [2512_SILK]
R207  10  RESISTOR2512_SILK  [2512_SILK]
R208  DNP  RESISTORR_0603_SILK  [0603_SILK]
R209  10  RESISTOR2512_SILK  [2512_SILK]
R210  DNP  RESISTORR_0603_SILK  [0603_SILK]
R211  RT100K  RESISTORR_0603_SILK  [0603_SILK]
R212  10  RESISTOR2512_SILK  [2512_SILK]
R213  RT100K  RESISTORR_0603_SILK  [0603_SILK]
R214  10  RESISTOR2512_SILK  [2512_SILK]
R216  10  RESISTOR2512_SILK  [2512_SILK]
R217  10  RESISTOR2512_SILK  [2512_SILK]
R218  10  RESISTOR2512_SILK  [2512_SILK]
R219  10  RESISTOR2512_SILK  [2512_SILK]
R220  10  RESISTOR2512_SILK  [2512_SILK]
R221  10  RESISTOR2512_SILK  [2512_SILK]
U3  LTC6803-3  [SSOP44]

### Nets
5V_SHDN: R62.P1 R88.P1 ; also sheet 1,2
C0: C12.P2 C27.P2 D217.1(A) JP111.13 LED1.2(C) R38.P2 R221.1 U3.29(C0)
C1: C27.P1 C28.P2 R2.P1 U3.27(C1)
C2: C28.P1 C29.P2 R5.P1 U3.25(C2)
C3: C29.P1 C30.P2 R12.P1 U3.23(C3)
C4: C30.P1 C31.P2 R21.P1 U3.21(C4)
C5: C31.P1 C32.P2 R27.P1 U3.19(C5)
C6: C32.P1 C33.P2 R30.P1 U3.17(C6)
C7: C33.P1 C34.P2 R33.P1 U3.15(C7)
C8: C34.P1 C36.P2 R42.P1 U3.13(C8)
C9: C36.P1 C37.P2 R49.P1 U3.11(C9)
C10: C37.P1 C39.P2 R57.P1 U3.9(C10)
C11: C39.P1 C42.P2 R65.P1 U3.7(C11)
C12: C42.P1 R76.P1 U3.5(C12)
CAN_SHDN: R69.P1 ; also sheet 1
CELL1: C11.P2 C12.P1 D1.3(C) D211.1(A) D217.3(C) JP111.12 LED2.2(C) Q222.2(S) R2.P2 R220.1
CELL2: C10.P2 C11.P1 D2.3(C) D211.3(C) D218.1(A) JP111.11 LED3.2(C) Q221.2(S) R5.P2 R219.1
CELL3: C9.P2 C10.P1 D4.3(C) D212.1(A) D218.3(C) JP111.10 LED4.2(C) Q220.2(S) R12.P2 R218.1
CELL4: C8.P2 C9.P1 D5.3(C) D212.3(C) D219.1(A) JP111.9 LED5.2(C) Q219.2(S) R21.P2 R217.1
CELL5: C7.P2 C8.P1 D7.3(C) D213.1(A) D219.3(C) JP111.8 LED6.2(C) Q214.2(S) R27.P2 R216.1
CELL6: C6.P2 C7.P1 D8.3(C) D213.3(C) D220.1(A) JP111.7 LED7.2(C) Q212.2(S) R30.P2 R214.1
CELL7: C5.P2 C6.P1 D10.3(C) D214.1(A) D220.3(C) JP111.6 LED8.2(C) Q211.2(S) R33.P2 R212.1
CELL8: C4.P2 C5.P1 D11.3(C) D214.3(C) D221.1(A) JP111.5 LED9.2(C) Q209.2(S) R42.P2 R209.1
CELL9: C3.P2 C4.P1 D12.3(C) D215.1(A) D221.3(C) JP111.4 LED10.2(C) Q205.2(S) R49.P2 R207.1
CELL10: C2.P2 C3.P1 D14.3(C) D215.3(C) D222.1(A) JP111.3 LED11.2(C) Q204.2(S) R57.P2 R205.1
CELL11: C1.P2 C2.P1 D16.3(C) D216.1(A) D222.3(C) JP111.2 LED12.2(C) Q201.2(S) R65.P2 R204.1
CELL12: C1.P1 D19.3(C) D216.3(C) JP111.1 L1.P1 Q200.2(S) R76.P2
CHRG_SHDN: R73.P1 ; also sheet 1,2
CSBO: JP10.P2 U3.1(CSBO)
GND: C38.P2 C41.P2 C45.P2 C47.P2 D208.1(A) JP10.P1 R38.P1 R79.P1 R208.P1 R210.P1 R211.P1 R213.P1 U3.30(V-) U3.31(NC) ; also sheet 1,2
GPIO1: JP9.P1 R63.P1 R69.P2 U3.38(GPIO1)
GPIO2: JP9.P2 R62.P2 R68.P1 U3.39(GPIO2)
LOAD_SHDN: R90.P1 ; also sheet 1,2
N$1: R45.P1 R211.P2 U3.32(VTEMP1)
N$5: D20.1(A) R88.P2
N$13: JP111.14 R41.P1 R213.P2 U3.33(VTEMP2)
N$16: C38.P1 R41.P2 R45.P2 U3.34(VREF)
N$17: D1.1(A) Q222.1(G) R1.P2
N$18: Q222.3(D) R3.P2 R221.2
N$20: D2.1(A) Q221.1(G) R4.P2
N$21: Q221.3(D) R6.P2 R220.2
N$24: D4.1(A) Q220.1(G) R11.P2
N$32: Q220.3(D) R13.P2 R219.2
N$38: D5.1(A) Q219.1(G) R19.P2
N$41: Q219.3(D) R22.P2 R218.2
N$42: D7.1(A) Q214.1(G) R25.P2
N$43: Q214.3(D) R28.P2 R217.2
N$44: D8.1(A) Q212.1(G) R29.P2
N$47: Q212.3(D) R31.P2 R216.2
N$48: D10.1(A) Q211.1(G) R32.P2
N$49: Q211.3(D) R34.P2 R214.2
N$50: D11.1(A) Q209.1(G) R39.P2
N$51: Q209.3(D) R43.P2 R212.2
N$52: D12.1(A) Q205.1(G) R46.P2
N$53: Q205.3(D) R50.P2 R209.2
N$54: D14.1(A) Q204.1(G) R52.P2
N$55: Q204.3(D) R58.P2 R207.2
N$56: D16.1(A) Q201.1(G) R61.P2
N$57: Q201.3(D) R66.P2 R205.2
N$59: D19.1(A) Q200.1(G) R74.P2
N$60: Q200.3(D) R75.P2 R204.2
N$90: D208.3(C) L1.P2 R80.P1
N$93: D15.1(A) R73.P2
N$94: D17.1(A) R90.P2
N$101: LED6.1(A) R31.P1
N$102: LED5.1(A) R28.P1
N$103: LED4.1(A) R22.P1
N$104: LED3.1(A) R13.P1
N$105: LED2.1(A) R6.P1
N$106: LED1.1(A) R3.P1
N$108: LED7.1(A) R34.P1
N$109: LED8.1(A) R43.P1
N$110: LED9.1(A) R50.P1
N$111: LED10.1(A) R58.P1
N$112: LED11.1(A) R66.P1
N$113: LED12.1(A) R75.P1
S1: R1.P1 U3.28(S1)
S2: R4.P1 U3.26(S2)
S3: R11.P1 U3.24(S3)
S4: R19.P1 U3.22(S4)
S5: R25.P1 U3.20(S5)
S6: R29.P1 U3.18(S6)
S7: R32.P1 U3.16(S7)
S8: R39.P1 U3.14(S8)
S9: R46.P1 U3.12(S9)
S10: R52.P1 U3.10(S10)
S11: R61.P1 U3.8(S11)
S12: R74.P1 U3.6(S12)
SCKO: JP10.P4 U3.3(SCKO)
SDOI: JP10.P3 U3.2(SDOI)
SPI1_CS: R59.P1 U3.44(CSBI) ; also sheet 1
SPI1_MISO: R64.P1 U3.43(SDO) ; also sheet 1
SPI1_MOSI: R67.P1 U3.42(SDI) ; also sheet 1
SPI1_SCK: R71.P1 U3.41(SCKI) ; also sheet 1
TOS: R54.P1 R210.P2 U3.36(TOS)
V+: C45.P1 JP10.P5 R80.P2 U3.4(V+)
VMODE: R72.P1 R208.P2 U3.40(VMODE)
VREG: C41.P1 C47.P1 R54.P2 R59.P2 R63.P2 R64.P2 R67.P2 R68.P2 R71.P2 R72.P2 R77.P2 U3.35(VREG)
WDTB: D15.3(C) D17.3(C) D20.3(C) R77.P1 R79.P2 U3.37(WDTB)

## Library data of the parts
BOOT RESET USER1 USER2 = 1_BES_ELECTROMECHANICAL:SWITCH_MOMENT
C1-C82 = 1_BES_Passives:CAPACITOR: SMT Capacitor
D1 D2 D4-D8 D10-D14 D16 D19 D25 D200 D202 D207 D208 D211-D222 = 1_BES_Discretesemiconductors:ZENER: Zener diode
D3 D9 D18 D24 = 1_BES_Discretesemiconductors:SURGESUPPRESSOR
D15 D17 D20 D23 D201 D210 = 1_BES_Discretesemiconductors:DIODE_SCHOTTKY: 5A HIGH VOLTAGE SCHOTTKY BARRIER RECTIFIER
D21 D22 D204-D206 D209 = 1_BES_Discretesemiconductors:DIODE_SCHOTTKY_SERIES
D203 = 1_BES_Discretesemiconductors:SUPPRESSOR_DUAL
HEAT1 = 1_BES_ELECTROMECHANICAL:HEATSINK
JP1 JP12 JP20 = 1_BES_ELECTROMECHANICAL:HEADER-1PIN
JP2-JP8 JP11 JP21 JP22 = 1_BES_ELECTROMECHANICAL:CONNECTOR-1PIN
JP9 JP13 JP14 JP17 = 1_BES_ELECTROMECHANICAL:HEADER-2PIN
JP10 = 1_BES_ELECTROMECHANICAL:HEADER-5PIN
JP15 = 1_BES_ELECTROMECHANICAL:USB_MICROB
JP16 = con-molex:C-GRID-12: CONNECTOR wire to board 2.54 mm (0.100") pitch header; OC_FARNELL: unknown; OC_NEWARK: unknown
JP18 = 1_BES_ELECTROMECHANICAL:HEADER-6PIN
JP19 = 1_BES_ELECTROMECHANICAL:MICROSD
JP111 = con-molex:C-GRID-14: CONNECTOR wire to board 2.54 mm (0.100") pitch header; OC_FARNELL: unknown; OC_NEWARK: unknown
JTAG = 1_BES_ELECTROMECHANICAL:JTAG_9PIN
L1 L2 L4 = 1_BES_Passives:INDUCTOR: SMT Inductor
L3 = 1_BES_Magnetics:EMI_FILTER_2MODE
LED1-LED12 = 1_BES_Optoelectronics:LED: Chip Mount, SMT, LED
LED13 = 1_BES_Optoelectronics:LED_RGB: LED RED/GREEN/BLUE PLCC6 SMD
LOGO1 = 1_BES_Asthetics:LOGO: BES Square Logo
Q1 Q206-Q208 Q210 Q213 = 1_BES_Discretesemiconductors:MOSFET_N: N-Channel MOSFET
Q2 Q3 Q200-Q205 Q209 Q211 Q212 Q214-Q222 = 1_BES_Discretesemiconductors:MOSFET_P: P-Channel MOSFET SMD, Vishay
R1-R134 R200-R221 = 1_BES_Passives:RESISTOR: Resistor, Chip Mount, SMT
TP1-TP8 = 1_BES_ELECTROMECHANICAL:TEST_POINT
U1 U4 = 1_BES_PowerIC:LT4356: Surge stopper with overcurrent and undervoltage protection =) 2-14-13
U2 U5 = 1_BES_Sensors:LT1999
U3 = 1_BES_PowerIC:LTC6803-3: Multicell Battery Stack Monitor BH 2-14-13
U6 = 1_BES_DIGITALIC:STM32F303
U7 = 1_BES_DIGITALIC:ADM3054
U8 = 1_BES_PowerIC:LTC1754-X: Micropower Regulated 3.3V/5V Charge Pump with Shutdown
U9 = 1_BES_PowerIC:LT3990: Fixed output voltages 3.3-5V 62V, 350mA Step-Down Regulator with 2.5μA Quiescent Current and Integrated Diodes BH 2-13-14 check pad
U10 = 1_BES_PowerIC:VICOR_MICRO
X2 = 1_BES_Timing:CRYSTAL_ABRACOM_AB: Crystals by abracom SMD/SMT LEAVE ABS25 PIN 2 & 3 FLOATING FOR ELECTRADE ARRANGEMENT!
X3 = 1_BES_Timing:CRYSTAL